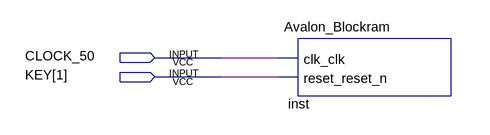
[diagram p0: schematic sheet]
// Quartus schematic RISCV_Blockram.bdf as structural Verilog: 1 symbols, 2 pins
module RISCV_Blockram (
  input  CLOCK_50,
  input  [1:1] KEY
);

  Avalon_Blockram inst (.clk_clk(CLOCK_50), .reset_reset_n(KEY[1]));
endmodule
